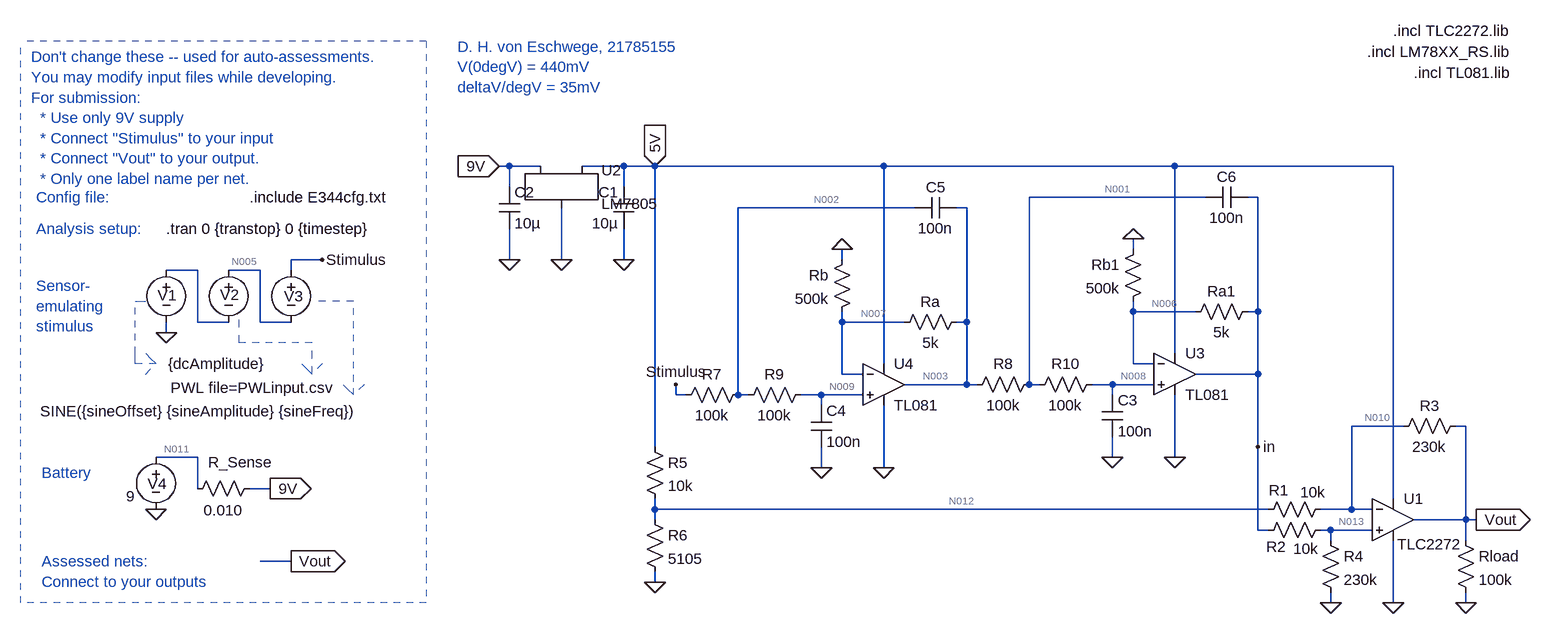
[diagram p0: schematic von_Eschwege_21785155_A1.asc]
von_Eschwege_21785155_A1.asc, the LTspice schematic file:
Version 4
SHEET 1 1824 680
WIRE -1552 -1216 -1568 -1216
WIRE -1504 -1216 -1552 -1216
WIRE -1376 -1216 -1440 -1216
WIRE -1328 -1216 -1376 -1216
WIRE -976 -1216 -1328 -1216
WIRE -528 -1216 -976 -1216
WIRE -192 -1216 -528 -1216
WIRE -1552 -1184 -1552 -1216
WIRE -1376 -1184 -1376 -1216
WIRE -480 -1168 -752 -1168
WIRE -400 -1168 -416 -1168
WIRE -928 -1152 -1200 -1152
WIRE -848 -1152 -864 -1152
WIRE -592 -1088 -592 -1104
WIRE -1840 -1072 -1888 -1072
WIRE -1552 -1072 -1552 -1120
WIRE -1472 -1072 -1472 -1152
WIRE -1376 -1072 -1376 -1120
WIRE -1040 -1072 -1040 -1088
WIRE -2032 -1056 -2080 -1056
WIRE -1936 -1056 -1984 -1056
WIRE -1888 -1056 -1888 -1072
WIRE -592 -992 -592 -1008
WIRE -496 -992 -592 -992
WIRE -400 -992 -400 -1168
WIRE -400 -992 -416 -992
WIRE -2032 -976 -2032 -1056
WIRE -1984 -976 -2032 -976
WIRE -1936 -976 -1936 -1056
WIRE -1888 -976 -1936 -976
WIRE -1040 -976 -1040 -992
WIRE -944 -976 -1040 -976
WIRE -848 -976 -848 -1152
WIRE -848 -976 -864 -976
WIRE -2080 -960 -2080 -976
WIRE -528 -928 -528 -1216
WIRE -976 -912 -976 -1216
WIRE -592 -912 -592 -992
WIRE -560 -912 -592 -912
WIRE -1040 -896 -1040 -976
WIRE -1008 -896 -1040 -896
WIRE -400 -896 -400 -992
WIRE -400 -896 -496 -896
WIRE -848 -880 -848 -976
WIRE -848 -880 -944 -880
WIRE -832 -880 -848 -880
WIRE -752 -880 -752 -1168
WIRE -736 -880 -752 -880
WIRE -624 -880 -656 -880
WIRE -560 -880 -624 -880
WIRE -1296 -864 -1296 -880
WIRE -1280 -864 -1296 -864
WIRE -1200 -864 -1200 -1152
WIRE -1184 -864 -1200 -864
WIRE -1072 -864 -1104 -864
WIRE -1008 -864 -1072 -864
WIRE -624 -864 -624 -880
WIRE -1072 -848 -1072 -864
WIRE -176 -816 -256 -816
WIRE -80 -816 -96 -816
WIRE -1328 -784 -1328 -1216
WIRE -400 -784 -400 -896
WIRE -2032 -768 -2096 -768
WIRE -624 -768 -624 -800
WIRE -528 -768 -528 -864
WIRE -1072 -752 -1072 -784
WIRE -976 -752 -976 -848
WIRE -2032 -720 -2032 -768
WIRE -1920 -720 -1952 -720
WIRE -192 -704 -192 -1216
WIRE -1328 -688 -1328 -704
WIRE -384 -688 -1328 -688
WIRE -256 -688 -256 -816
WIRE -256 -688 -304 -688
WIRE -224 -688 -256 -688
WIRE -1328 -672 -1328 -688
WIRE -80 -672 -80 -816
WIRE -80 -672 -160 -672
WIRE -64 -672 -80 -672
WIRE -400 -656 -400 -784
WIRE -384 -656 -400 -656
WIRE -288 -656 -304 -656
WIRE -224 -656 -288 -656
WIRE -288 -640 -288 -656
WIRE -80 -640 -80 -672
WIRE -1888 -608 -1936 -608
WIRE -1328 -576 -1328 -592
WIRE -288 -544 -288 -560
WIRE -192 -544 -192 -640
WIRE -80 -544 -80 -560
FLAG -64 -672 Vout
IOPIN -64 -672 Out
FLAG -2080 -960 0
FLAG -1840 -1072 Stimulus
FLAG -1920 -720 9V
IOPIN -1920 -720 Out
FLAG -2096 -688 0
FLAG -1568 -1216 9V
IOPIN -1568 -1216 In
FLAG -1888 -608 Vout
IOPIN -1888 -608 Out
FLAG -1472 -1072 0
FLAG -1552 -1072 0
FLAG -1376 -1072 0
FLAG -80 -544 0
FLAG -192 -544 0
FLAG -1328 -576 0
FLAG -288 -544 0
FLAG -1296 -880 Stimulus
FLAG -976 -752 0
FLAG -1072 -752 0
FLAG -1040 -1088 0
FLAG -528 -768 0
FLAG -624 -768 0
FLAG -592 -1104 0
FLAG -1328 -1216 5V
IOPIN -1328 -1216 In
FLAG -400 -784 in
SYMBOL voltage -1984 -1072 R0
WINDOW 123 0 0 Left 0
WINDOW 39 0 0 Left 0
WINDOW 3 -89 197 Left 2
WINDOW 0 -13 54 Left 2
SYMATTR Value PWL file=PWLinput.csv
SYMATTR InstName V2
SYMBOL voltage -1888 -1072 R0
WINDOW 123 24 44 Left 2
WINDOW 39 0 0 Left 0
WINDOW 3 -386 233 Left 2
WINDOW 0 -11 56 Left 2
SYMATTR Value SINE({sineOffset} {sineAmplitude} {sineFreq})
SYMATTR InstName V3
SYMBOL voltage -2080 -1072 R0
WINDOW 123 0 0 Left 0
WINDOW 39 0 0 Left 0
WINDOW 3 3 160 Left 2
WINDOW 0 -13 55 Left 2
SYMATTR Value {dcAmplitude}
SYMATTR InstName V1
SYMBOL voltage -2096 -784 R0
WINDOW 123 24 44 Left 2
WINDOW 39 0 0 Left 0
WINDOW 3 -46 76 Left 2
WINDOW 0 -13 57 Left 2
SYMATTR Value 9
SYMATTR InstName V4
SYMBOL res -1936 -736 R90
WINDOW 0 -9 30 VBottom 2
WINDOW 3 34 56 VTop 2
SYMATTR InstName R_Sense
SYMATTR Value 0.010
SYMBOL cap -1360 -1184 M0
SYMATTR InstName C1
SYMATTR Value 10µ
SYMBOL cap -1568 -1184 R0
SYMATTR InstName C2
SYMATTR Value 10µ
SYMBOL res -96 -656 R0
SYMATTR InstName Rload
SYMATTR Value 100k
SYMBOL res -80 -832 R90
WINDOW 0 0 56 VBottom 2
WINDOW 3 32 56 VTop 2
SYMATTR InstName R3
SYMATTR Value 230k
SYMBOL res -288 -704 R90
WINDOW 0 2 80 VBottom 2
WINDOW 3 -26 27 VTop 2
SYMATTR InstName R1
SYMATTR Value 10k
SYMBOL Opamps\\opamp2 -192 -736 R0
WINDOW 3 6 102 Left 2
SYMATTR Value TLC2272
SYMATTR InstName U1
SYMBOL res -1344 -688 R0
SYMATTR InstName R6
SYMATTR Value 5105
SYMBOL res -1344 -800 R0
SYMATTR InstName R5
SYMATTR Value 10k
SYMBOL res -304 -656 R0
SYMATTR InstName R4
SYMATTR Value 230k
SYMBOL res -288 -672 R90
WINDOW 0 57 84 VBottom 2
WINDOW 3 29 38 VTop 2
SYMATTR InstName R2
SYMATTR Value 10k
SYMBOL res -1184 -880 R90
WINDOW 0 0 56 VBottom 2
WINDOW 3 32 56 VTop 2
SYMATTR InstName R7
SYMATTR Value 100k
SYMBOL cap -1088 -848 R0
SYMATTR InstName C4
SYMATTR Value 100n
SYMBOL Opamps\\opamp2 -976 -944 R0
SYMATTR InstName U4
SYMATTR Value TL081
SYMBOL res -1088 -880 R90
WINDOW 0 0 56 VBottom 2
WINDOW 3 32 56 VTop 2
SYMATTR InstName R9
SYMATTR Value 100k
SYMBOL res -848 -992 R90
WINDOW 0 0 56 VBottom 2
WINDOW 3 32 56 VTop 2
SYMATTR InstName Ra
SYMATTR Value 5k
SYMBOL res -1024 -1088 M0
SYMATTR InstName Rb
SYMATTR Value 500k
SYMBOL cap -864 -1168 R90
WINDOW 0 0 32 VBottom 2
WINDOW 3 32 32 VTop 2
SYMATTR InstName C5
SYMATTR Value 100n
SYMBOL res -736 -896 R90
WINDOW 0 0 56 VBottom 2
WINDOW 3 32 56 VTop 2
SYMATTR InstName R8
SYMATTR Value 100k
SYMBOL cap -640 -864 R0
SYMATTR InstName C3
SYMATTR Value 100n
SYMBOL Opamps\\opamp2 -528 -960 R0
SYMATTR InstName U3
SYMATTR Value TL081
SYMBOL res -640 -896 R90
WINDOW 0 0 56 VBottom 2
WINDOW 3 32 56 VTop 2
SYMATTR InstName R10
SYMATTR Value 100k
SYMBOL res -400 -1008 R90
WINDOW 0 0 56 VBottom 2
WINDOW 3 32 56 VTop 2
SYMATTR InstName Ra1
SYMATTR Value 5k
SYMBOL res -576 -1104 M0
SYMATTR InstName Rb1
SYMATTR Value 500k
SYMBOL cap -416 -1184 R90
WINDOW 0 0 32 VBottom 2
WINDOW 3 32 32 VTop 2
SYMATTR InstName C6
SYMATTR Value 100n
SYMBOL LM7805 -1472 -1200 R0
SYMATTR InstName U2
TEXT -2080 -1120 Left 2 !.tran 0 {transtop} 0 {timestep}
TEXT -1952 -1168 Left 2 !.include E344cfg.txt
TEXT -2288 -1384 Left 2 ;Don't change these -- used for auto-assessments.\nYou may modify input files while developing.\nFor submission: \n  * Use only 9V supply \n  * Connect "Stimulus" to your input\n  * Connect "Vout" to your output.\n  * Only one label name per net.
TEXT -2280 -1168 Left 2 ;Config file:
TEXT -2280 -1120 Left 2 ;Analysis setup:
TEXT -2272 -744 Left 2 ;Battery
TEXT -2280 -1032 Left 2 ;Sensor-\nemulating \nstimulus
TEXT -2272 -608 Left 2 ;Assessed nets:\nConnect to your outputs
TEXT -1632 -1400 Left 2 ;D. H. von Eschwege, 21785155\nV(0degV) = 440mV\ndeltaV/degV = 35mV
TEXT -192 -1424 Left 2 !.incl TLC2272.lib
TEXT -232 -1392 Left 2 !.incl LM78XX_RS.lib
TEXT -160 -1360 Left 2 !.incl TL081.lib
LINE Normal -1792 -1008 -1856 -1008 2
LINE Normal -1792 -864 -1792 -1008 2
LINE Normal -1808 -880 -1792 -864 2
LINE Normal -1792 -864 -1808 -880 2
LINE Normal -1776 -880 -1792 -864 2
LINE Normal -2128 -1008 -2112 -1008 2
LINE Normal -2128 -928 -2128 -1008 2
LINE Normal -2128 -912 -2128 -928 2
LINE Normal -2096 -912 -2128 -912 2
LINE Normal -2112 -928 -2096 -912 2
LINE Normal -2096 -912 -2112 -928 2
LINE Normal -2112 -896 -2096 -912 2
LINE Normal -1968 -944 -1968 -992 2
LINE Normal -1856 -944 -1968 -944 2
LINE Normal -1856 -896 -1856 -944 2
LINE Normal -1872 -912 -1856 -896 2
LINE Normal -1856 -896 -1872 -912 2
LINE Normal -1840 -912 -1856 -896 2
LINE Normal -2304 -544 -2304 -1408 1
LINE Normal -1680 -1408 -1680 -544 1
LINE Normal -1680 -544 -2304 -544 1
LINE Normal -1680 -1408 -2304 -1408 1

The netlist it stands for:
* von_Eschwege_21785155_A1.asc
V2 N005 N004 PWL file=PWLinput.csv
V3 Stimulus N005 SINE({sineOffset} {sineAmplitude} {sineFreq})
V1 N004 0 {dcAmplitude}
V4 N011 0 9
R_Sense 9V N011 0.010
C1 5V 0 10µ
C2 9V 0 10µ
Rload Vout 0 100k
R3 Vout N010 230k
R1 N010 N012 10k
XU1 N013 N010 5V 0 Vout TLC2272  ; pins In+ In- V+ V- OUT
R6 N012 0 5105
R5 5V N012 10k
R4 N013 0 230k
R2 N013 in 10k
R7 N002 Stimulus 100k
C4 N009 0 100n
XU4 N009 N007 5V 0 N003 TL081  ; pins In+ In- V+ V- OUT
R9 N009 N002 100k
Ra N003 N007 5k
Rb 0 N007 500k
C5 N003 N002 100n
R8 N001 N003 100k
C3 N008 0 100n
XU3 N008 N006 5V 0 in TL081  ; pins In+ In- V+ V- OUT
R10 N008 N001 100k
Ra1 in N006 5k
Rb1 0 N006 500k
C6 in N001 100n
XU2 9V 0 5V LM7805
.tran 0 {transtop} 0 {timestep}
.include E344cfg.txt
* Don't change these -- used for auto-assessments.
* You may modify input files while developing.
* For submission:
*   * Use only 9V supply
*   * Connect "Stimulus" to your input
*   * Connect "Vout" to your output.
*   * Only one label name per net.
* Config file:
* Analysis setup:
* Battery
* Sensor-
* emulating
* stimulus
* Assessed nets:
* Connect to your outputs
* D. H. von Eschwege, 21785155
* V(0degV) = 440mV
* deltaV/degV = 35mV
.incl TLC2272.lib
.incl LM78XX_RS.lib
.incl TL081.lib
.backanno
.end

* Results of the author's LTspice run, read from the files saved beside the schematic
* Operating Point, zero values left out:
*   V(n005) = 1.63 V
*   V(stimulus) = 1.63 V
*   V(n011) = 9 V
*   V(9v) = 9 V
*   V(5v) = 5.003 V
*   V(vout) = 43.23 mV
*   V(n010) = 1.6 V
*   V(n012) = 1.668 V
*   V(n013) = 1.6 V
*   V(in) = 1.669 V
*   V(n002) = 1.63 V
*   V(n009) = 1.63 V
*   V(n003) = 1.651 V
*   V(n007) = 1.634 V
*   V(n001) = 1.651 V
*   V(n008) = 1.651 V
*   V(n006) = 1.653 V
*   I(C6) = 1.921 pA
*   I(C3) = 3.256 pA
*   I(Rb1) = -3.306 µA
*   I(Ra1) = 3.306 µA
*   I(R10) = -34.96 pA
*   I(R8) = -33.03 pA
*   I(Rb) = -3.269 µA
*   I(Ra) = 3.269 µA
*   I(R9) = -31.93 pA
*   I(R7) = -31.79 pA
*   I(R2) = -6.956 µA
*   I(R4) = 6.956 µA
*   I(R5) = 333.5 µA
*   I(R6) = 326.7 µA
*   I(R1) = -6.77 µA
*   I(R3) = -6.77 µA
*   I(Rload) = 432.3 nA
*   I(R_sense) = -12.81 mA
*   I(V4) = -12.81 mA
*   I(V1) = -31.79 pA
*   I(V3) = -31.79 pA
*   I(V2) = -31.79 pA
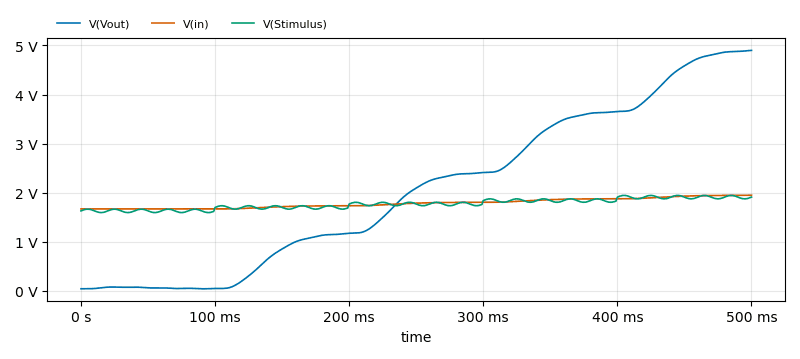
[diagram p1: Transient Analysis of von_Eschwege_21785155_A1.asc, plotted from the saved traces]
* Transient Analysis, 1 run:
*   V(Vout): min 42.35 mV, max 4.9 V, average 2.06 V, rms 2.631 V, last 4.9 V
*   V(in): min 1.669 V, max 1.948 V, average 1.785 V, rms 1.788 V, last 1.948 V
*   V(Stimulus): min 1.595 V, max 1.945 V, average 1.77 V, rms 1.773 V, last 1.911 V